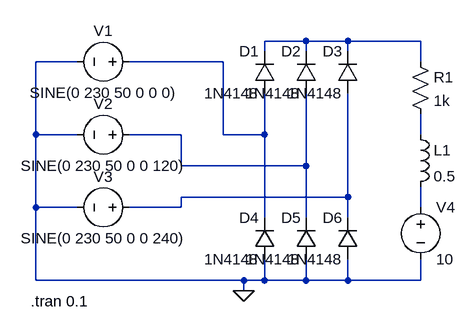
[diagram p0: schematic Lab2_14_02_2024_2_3PFRLE.asc]
Lab2_14_02_2024_2_3PFRLE.asc, the LTspice schematic file:
Version 4
SHEET 1 880 680
WIRE 192 -160 128 -160
WIRE 256 -160 192 -160
WIRE 368 -160 256 -160
WIRE 128 -144 128 -160
WIRE 192 -144 192 -160
WIRE 256 -144 256 -160
WIRE -160 -128 -224 -128
WIRE 64 -128 -80 -128
WIRE 368 -128 368 -160
WIRE -224 -16 -224 -128
WIRE -160 -16 -224 -16
WIRE 0 -16 -80 -16
WIRE 64 -16 64 -128
WIRE 128 -16 128 -80
WIRE 128 -16 64 -16
WIRE 368 -16 368 -48
WIRE 0 32 0 -16
WIRE 192 32 192 -80
WIRE 192 32 0 32
WIRE 256 80 256 -80
WIRE 256 80 0 80
WIRE -224 96 -224 -16
WIRE -160 96 -224 96
WIRE 0 96 0 80
WIRE 0 96 -80 96
WIRE 368 96 368 64
WIRE 128 112 128 -16
WIRE 192 112 192 32
WIRE 256 112 256 80
WIRE -224 208 -224 96
WIRE 96 208 -224 208
WIRE 128 208 128 176
WIRE 128 208 96 208
WIRE 192 208 192 176
WIRE 192 208 128 208
WIRE 256 208 256 176
WIRE 256 208 192 208
WIRE 368 208 368 176
WIRE 368 208 256 208
WIRE 96 224 96 208
FLAG 96 224 0
SYMBOL voltage -64 -128 R90
WINDOW 0 -32 56 VBottom 2
WINDOW 3 32 56 VTop 2
WINDOW 123 0 0 Left 0
WINDOW 39 0 0 Left 0
SYMATTR InstName V1
SYMATTR Value SINE(0 230 50 0 0 0)
SYMBOL res 352 -144 R0
SYMATTR InstName R1
SYMATTR Value 1k
SYMBOL voltage -64 -16 R90
WINDOW 0 -32 56 VBottom 2
WINDOW 3 32 56 VTop 2
WINDOW 123 0 0 Left 0
WINDOW 39 0 0 Left 0
SYMATTR InstName V2
SYMATTR Value SINE(0 230 50 0 0 120)
SYMBOL voltage -64 96 R90
WINDOW 0 -32 56 VBottom 2
WINDOW 3 32 56 VTop 2
WINDOW 123 0 0 Left 0
WINDOW 39 0 0 Left 0
SYMATTR InstName V3
SYMATTR Value SINE(0 230 50 0 0 240)
SYMBOL diode 144 -80 R180
WINDOW 0 24 64 Left 2
WINDOW 3 24 0 Left 2
SYMATTR InstName D1
SYMATTR Value 1N4148
SYMBOL diode 208 -80 R180
WINDOW 0 24 64 Left 2
WINDOW 3 24 0 Left 2
SYMATTR InstName D2
SYMATTR Value 1N4148
SYMBOL diode 272 -80 R180
WINDOW 0 24 64 Left 2
WINDOW 3 24 0 Left 2
SYMATTR InstName D3
SYMATTR Value 1N4148
SYMBOL diode 144 176 R180
WINDOW 0 24 64 Left 2
WINDOW 3 24 0 Left 2
SYMATTR InstName D4
SYMATTR Value 1N4148
SYMBOL diode 208 176 R180
WINDOW 0 24 64 Left 2
WINDOW 3 24 0 Left 2
SYMATTR InstName D5
SYMATTR Value 1N4148
SYMBOL diode 272 176 R180
WINDOW 0 24 64 Left 2
WINDOW 3 24 0 Left 2
SYMATTR InstName D6
SYMATTR Value 1N4148
SYMBOL ind 352 -32 R0
SYMATTR InstName L1
SYMATTR Value 0.5
SYMBOL voltage 368 80 R0
WINDOW 123 0 0 Left 0
WINDOW 39 0 0 Left 0
SYMATTR InstName V4
SYMATTR Value 10
TEXT -232 240 Left 2 !.tran 0.1

The netlist it stands for:
* Lab2_14_02_2024_2_3PFRLE.asc
V1 N002 0 SINE(0 230 50 0 0 0)
R1 N001 N004 1k
V2 N003 0 SINE(0 230 50 0 0 120)
V3 N005 0 SINE(0 230 50 0 0 240)
D1 N002 N001 1N4148
D2 N003 N001 1N4148
D3 N005 N001 1N4148
D4 0 N002 1N4148
D5 0 N003 1N4148
D6 0 N005 1N4148
L1 N004 N006 0.5
V4 N006 0 10
.model D D
.lib standard.dio
.tran 0.1
.backanno
.end